# Altium schematic sheet buck.SchDoc
size A4
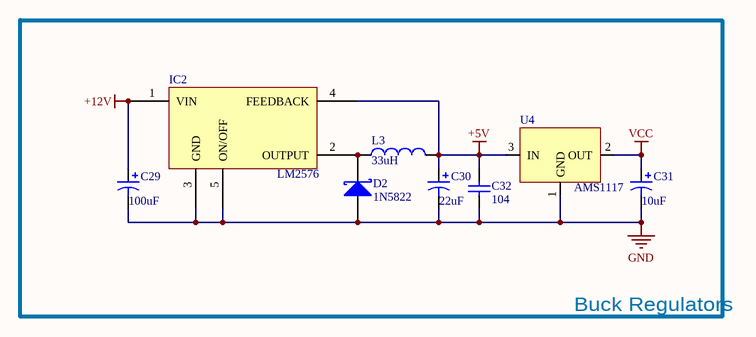
[diagram p0: buck.SchDoc]

## Parts
C29  100uF  [CM E(8*10.2)]
C30  22uF  [CD A(3216)]
C31  10uF  [CD A(3216)]
C32  104  [C 0603_L]
D2  1N5822  [SMC]
IC2  LM2576  [TO263-5A]
L3  33uH  [CDRH127]
U4  AMS1117  [SOT_223]

## Blocks framed on the sheet
Buck Regulators: C29-C32 D2 IC2 L3 U4

## Nets
+5V: C30.1 C32.2 IC2.4(FEEDBACK) L3.2 U4.3(IN)
+12V: C29.1 IC2.1(VIN)
GND: C29.2 C30.2 C31.2 C32.1 D2.1(A) IC2.3(GND) IC2.5(ON/OFF) U4.1(GND)
VCC: C31.1 U4.2(OUT)
NetD2_2: D2.2(K) IC2.2(OUTPUT) L3.1

## Library data of the parts
C29-C31 = Cap Pol1: Polarized Capacitor (Radial); Published: 8-Jun-2000; LatestRevisionDate: 17-Jul-2002; LatestRevisionNote: Re-released for DXP Platform.; PackageReference: RB7.6-15; Publisher: Altium Limited; PackageDescription: Polarized Capacitor (Radial); 2 Leads
  C29: Value: 100uF
  C30: Value: 22uF
  C31: Value: 10uF
C32 = Cap: Capacitor; Published: 8-Jun-2000; LatestRevisionDate: 17-Jul-2002; LatestRevisionNote: Re-released for DXP Platform.; PackageReference: RAD-0.3; Publisher: Altium Limited; PackageDescription: Radial Cap, Thru-Hole; 2 Leads; 0.3 in Pin Spacing; Value: 104
D2 = Diode 11DQ03: Schottky Rectifier; Published: 8-Jun-2000; LatestRevisionDate: 17-Jul-2002; LatestRevisionNote: Re-released for DXP Platform.; DatasheetVersion: Dec-1997; PackageReference: DO-204AL; Publisher: Altium Limited; PackageDescription: Diode, Axial; Body 5.2 x 2.7 mm (LxDia. max), Lead Dia. 0.86 mm (max); Code_JEDEC: DO-204-AL; ComponentLink1Description: Manufacturer Link; ComponentLink1URL: http://www.irf.com/; ComponentLink2Description: Datasheet; ComponentLink2URL: http://www.irf.com/product-info/datasheets/data/11dq03.pdf
IC2 = LM2576: 稳压
L3 = Inductor: Code_IEC: 1005; Published: 8-Jun-2000; LatestRevisionDate: 29-May-2009; LatestRevisionNote: IPC-7351 Footprint Added.; PackageReference: 0402-A; Publisher: Altium Limited; PackageDescription: Chip Inductor; Code_JEITA: 0402; Value: 33uH